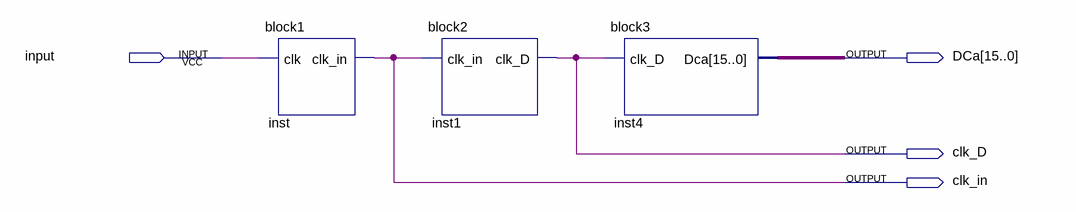
[diagram p0: schematic sheet]
// Quartus schematic lab2.bdf as structural Verilog: 3 symbols, 4 pins
module lab2 (
  input  \input ,
  output [15:0] DCa,
  output clk_D,
  output clk_in
);

  block1 inst (.clk(\input ), .clk_in(clk_in));
  block2 inst1 (.clk_in(clk_in), .clk_D(clk_D));
  block3 inst4 (.clk_D(clk_D), .Dca(DCa));
endmodule
